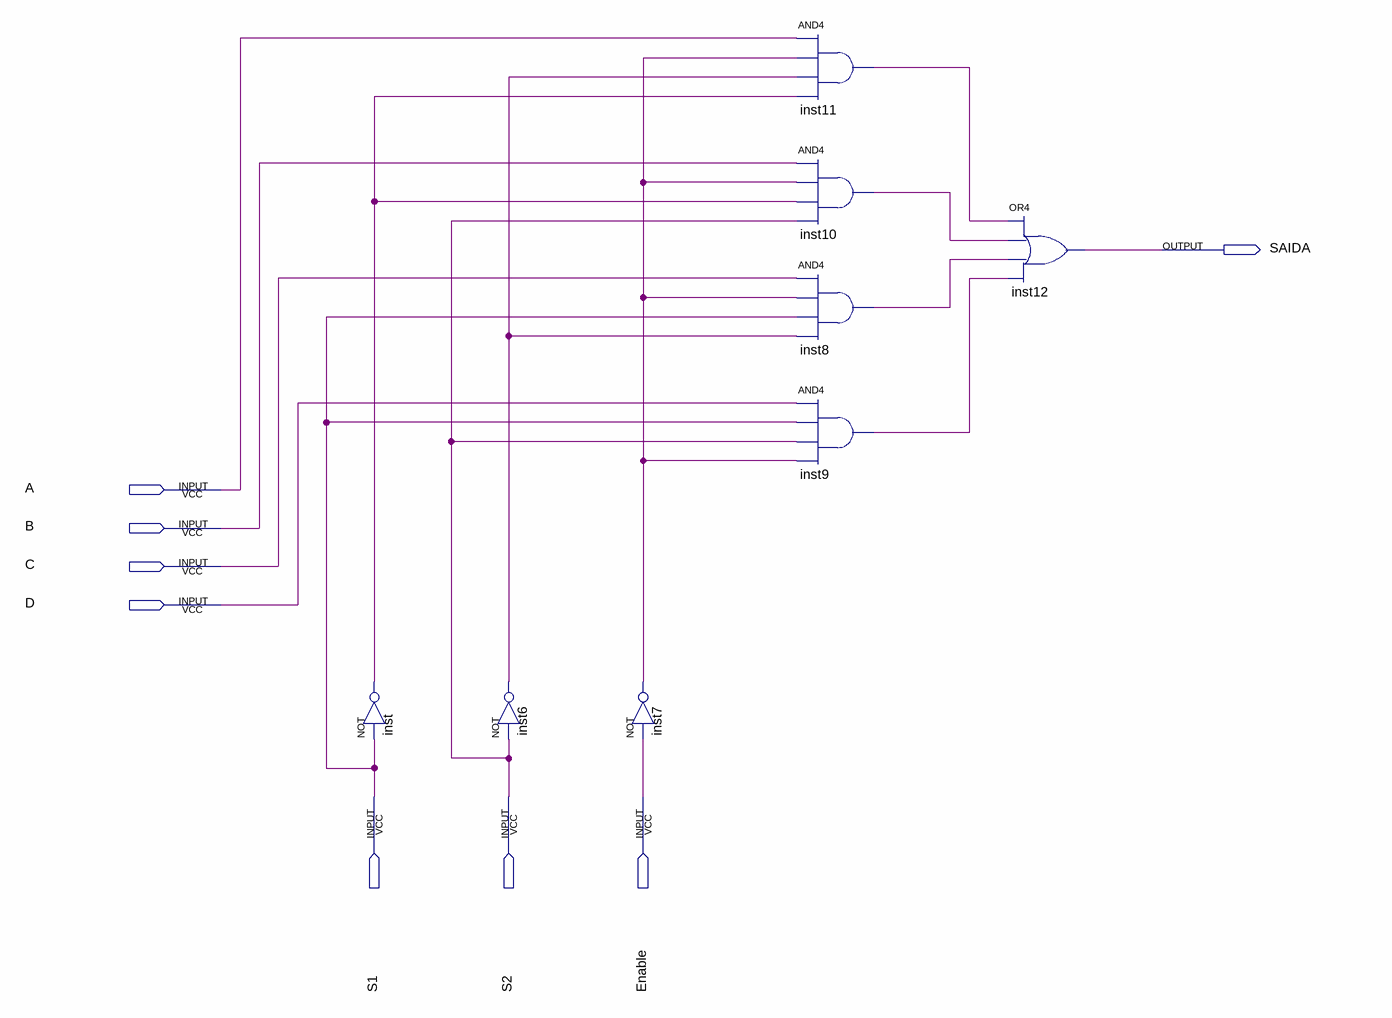
[diagram p0: schematic sheet]
// Quartus schematic MuxLetras.bdf as structural Verilog: 8 symbols, 8 pins
module MuxLetras (
  input  A,
  input  B,
  input  C,
  input  D,
  input  S1,
  input  S2,
  input  Enable,
  output SAIDA
);

  wire inst6_out, inst7_out, inst8_out, inst9_out, inst10_out, inst11_out, inst_out;

  not inst (inst_out, S1);
  not inst6 (inst6_out, S2);
  not inst7 (inst7_out, Enable);
  and inst11 (inst11_out, A, inst7_out, inst6_out, inst_out);
  and inst10 (inst10_out, B, inst7_out, inst_out, S2);
  and inst8 (inst8_out, C, inst7_out, S1, inst6_out);
  and inst9 (inst9_out, D, S1, S2, inst7_out);
  or inst12 (SAIDA, inst11_out, inst10_out, inst8_out, inst9_out);
endmodule
